# Altium project LOGTURTLE_APR_25_TX.PrjPcb (part 2 of 2)

## Sheet BiGaN.SchDoc
size A3; SheetNumber: 4; SheetTotal: 7
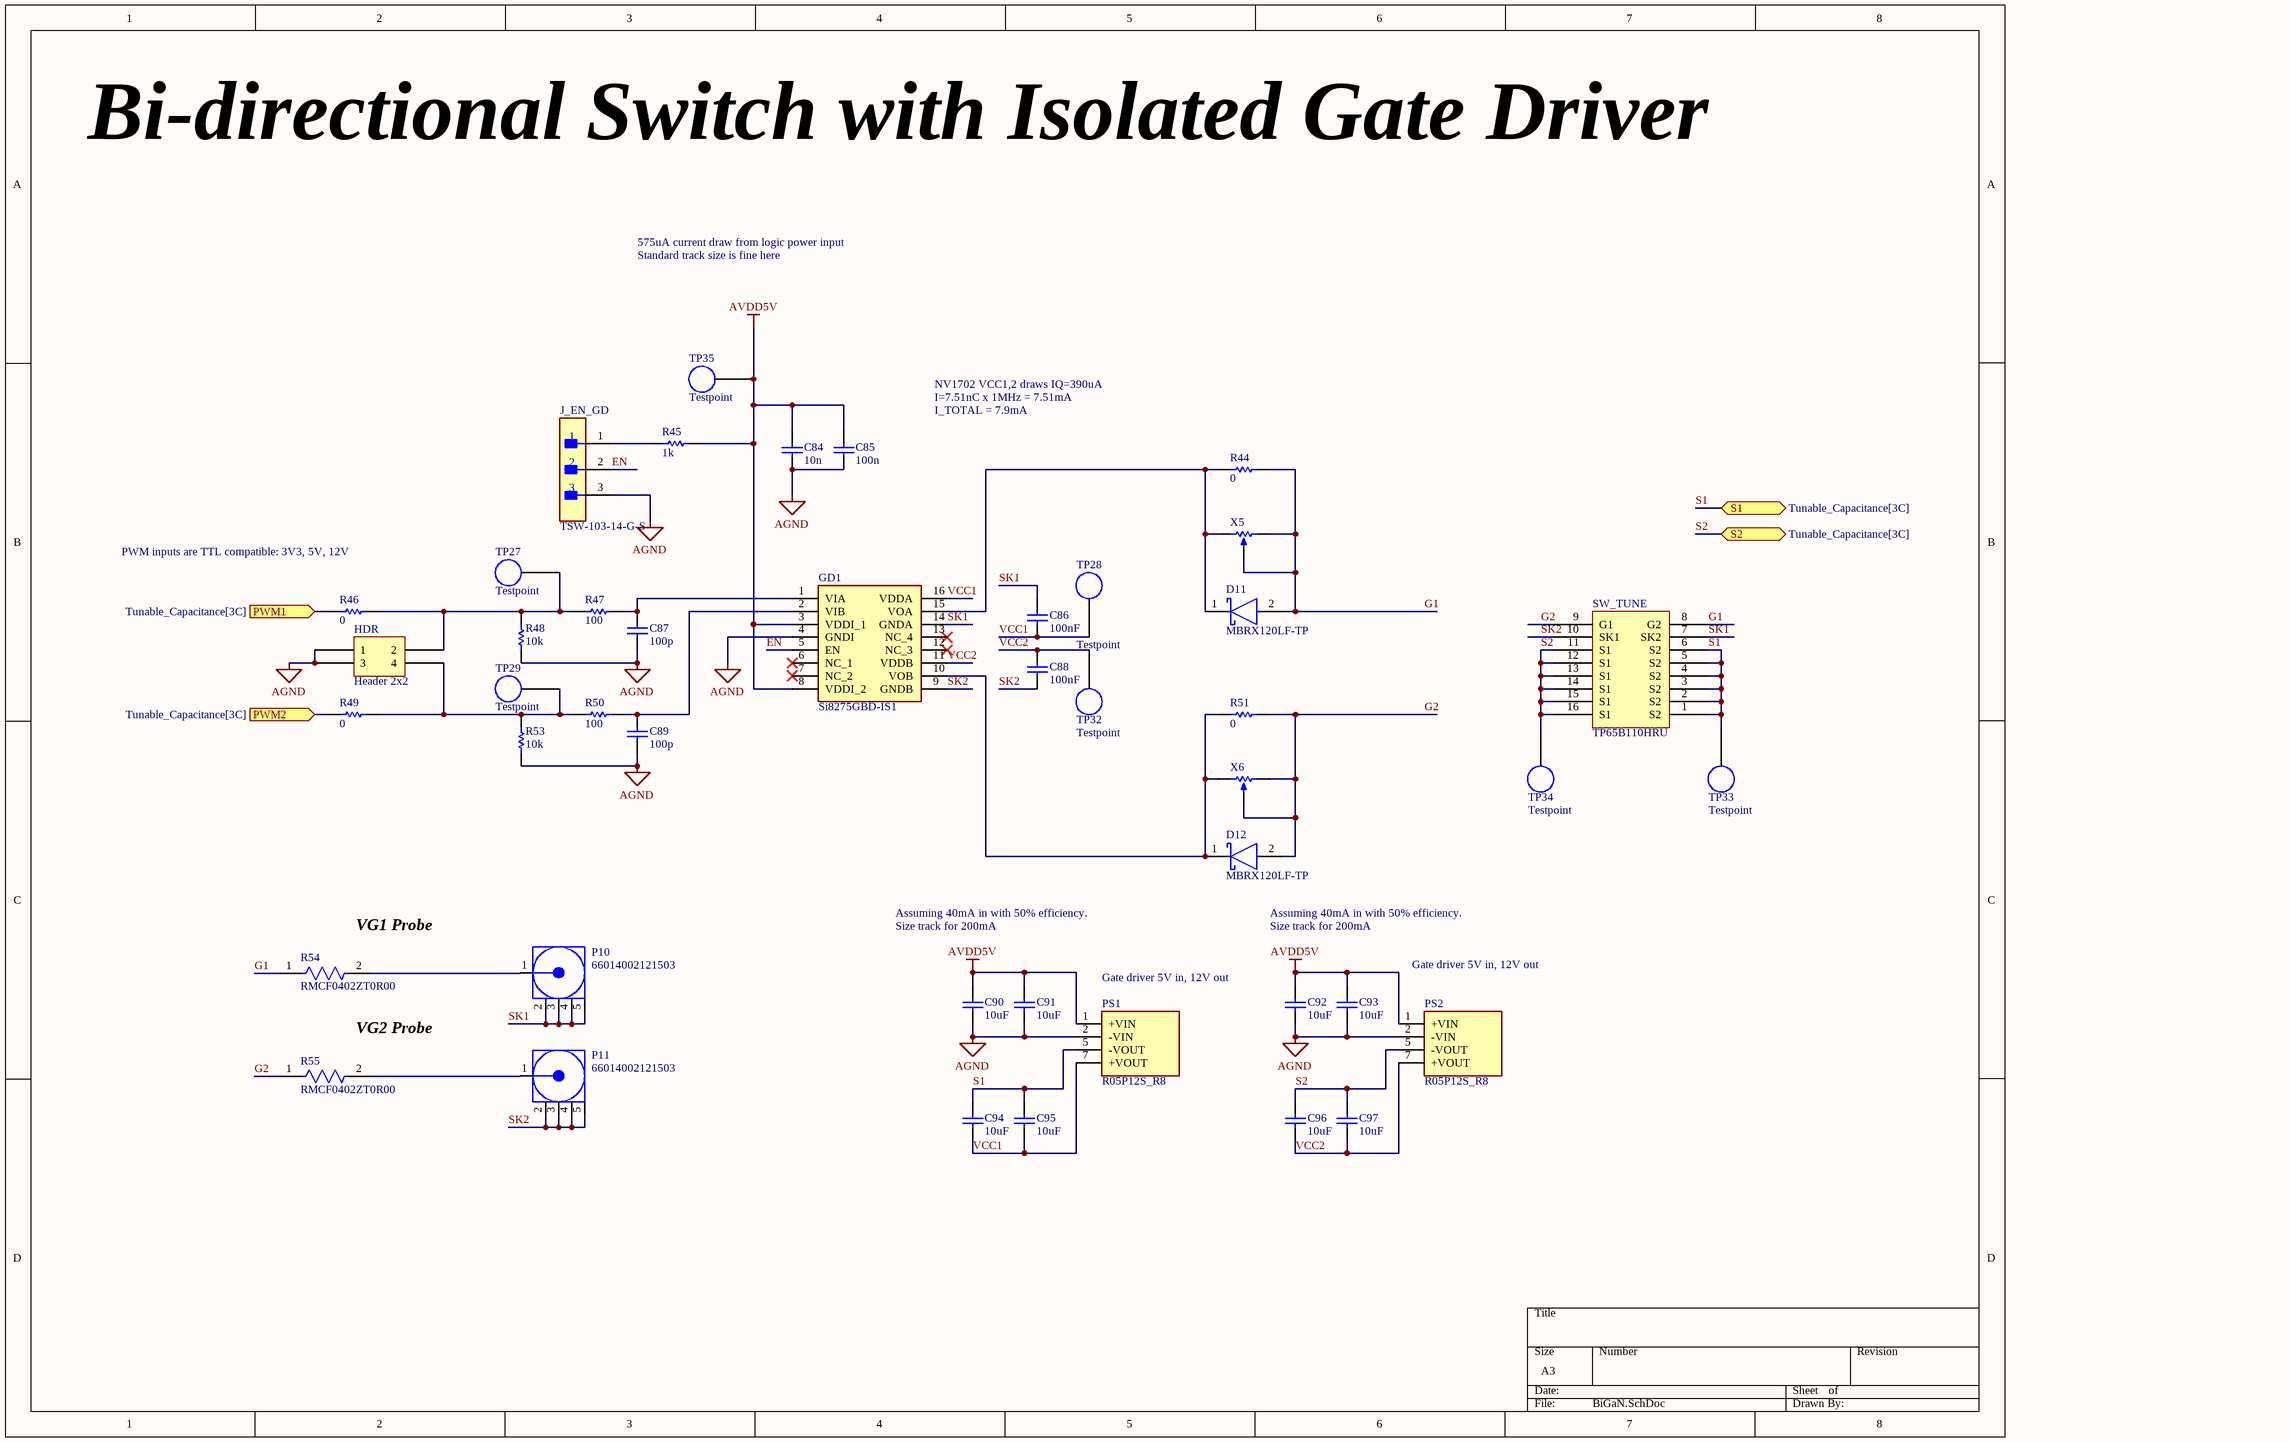
[diagram p4: BiGaN.SchDoc]

### Parts
C84  value 10n  [C0603]  (hidden comment: C0603C103K5RACTU)
C85  value 100n  [CAPC1608X95N]  (hidden comment: C0603C104K5RACTU7042)
C86  value 100nF  [CAPC1608X90N]  (hidden comment: 0.1μF)
C87  value 100p  [CAPC1608X90N]  (hidden comment: CL10C101JB8NNNC)
C88  value 100nF  [CAPC1608X90N]  (hidden comment: 0.1μF)
C89  value 100p  [CAPC1608X90N]  (hidden comment: CL10C101JB8NNNC)
C90  value 10uF  [CAPC2012X14N]  (hidden comment: 10μF)
C91  value 10uF  [CAPC2012X14N]  (hidden comment: 10μF)
C92  value 10uF  [CAPC2012X14N]  (hidden comment: 10μF)
C93  value 10uF  [CAPC2012X14N]  (hidden comment: 10μF)
C94  value 10uF  [CAPC2012X14N]  (hidden comment: 10μF)
C95  value 10uF  [CAPC2012X14N]  (hidden comment: 10μF)
C96  value 10uF  [CAPC2012X14N]  (hidden comment: 10μF)
C97  value 10uF  [CAPC2012X14N]  (hidden comment: 10μF)
D11  MBRX120LF-TP  [FP-SOD-123-IPC_A]
D12  MBRX120LF-TP  [FP-SOD-123-IPC_A]
GD1  Si8275GBD-IS1  [SOIC127P600X175-16N]
HDR  Header 2x2  [HEADER 2x2]
J_EN_GD  TSW-103-14-G-S  [FP-TSW-103-14-G-S-MFG]
P10  66014002121503  [66014002121503]
P11  66014002121503  [66014002121503]
PS1  R05P12S_R8  [R05P12SR8]
PS2  R05P12S_R8  [R05P12SR8]
R44  value 0  [RESC1608X55N]  (hidden comment: RC0603FR-070RL)
R45  value 1k  [RESC1608X55N]  (hidden comment: RC0603FR-071KL)
R46  value 0  [RESC1608X55N]  (hidden comment: RC0603FR-070RL)
R47  value 100  [RESC1608X55N]  (hidden comment: RC0603FR-07100RL)
R48  value 10k  [RESC1608X55N]  (hidden comment: RC0603FR0710KL)
R49  value 0  [RESC1608X55N]  (hidden comment: RC0603FR-070RL)
R50  value 100  [RESC1608X55N]  (hidden comment: RC0603FR-07100RL)
R51  value 0  [RESC1608X55N]  (hidden comment: RC0603FR-070RL)
R53  value 10k  [RESC1608X55N]  (hidden comment: RC0603FR0710KL)
R54  RMCF0402ZT0R00  [FP-RMCF0402-MFG]
R55  RMCF0402ZT0R00  [FP-RMCF0402-MFG]
SW_TUNE  TP65B110HRU  [NV6428]
TP27  Testpoint  [TP_5006]
TP28  Testpoint  [TP_5006]
TP29  Testpoint  [TP_5006]
TP32  Testpoint  [TP_5006]
TP33  Testpoint  [TP_5006]
TP34  Testpoint  [TP_5006]
TP35  Testpoint  [TP_5006]
X5  3296W-1-200LF  [3296W1200LF]  (value not drawn)
X6  3296W-1-200LF  [3296W1200LF]  (value not drawn)

### Ports
PWM1 (in, see Tunable_Capacitance[3C]), PWM2 (in, see Tunable_Capacitance[3C]), S1 (bidir, see Tunable_Capacitance[3C]), S2 (bidir, see Tunable_Capacitance[3C])

### Nets
AVDD5V: C84.2 C85.2 C90.2 C91.2 C92.2 C93.2 GD1.3(VDDI_1) GD1.8(VDDI_2) PS1.1(+VIN) PS2.1(+VIN) R45.2 TP35.1
S2: C84.1 C85.1 C87.1 C89.1 C90.1 C91.1 C92.1 C93.1 C96.1 C97.1 GD1.4(GNDI) HDR.1 HDR.3 J_EN_GD.3 PS1.2(-VIN) PS2.2(-VIN) PS2.5(-VOUT) R48.1 R53.1 SW_TUNE.11(S1) SW_TUNE.12(S1) SW_TUNE.13(S1) SW_TUNE.14(S1) SW_TUNE.15(S1) SW_TUNE.16(S1) TP34.1 ; port S2  [also labelled AGND]
EN: GD1.5(EN) J_EN_GD.2
G1: D11.2(A) R44.2 R54.1 SW_TUNE.8(G2) X5.2(BOT) X5.3(TAP)
G2: D12.2(A) R51.2 R55.1 SW_TUNE.9(G1) X6.2(BOT) X6.3(TAP)
PWM1_1: R46.1 ; port PWM1
PWM2_1: R49.1 ; port PWM2
S1: C94.1 C95.1 PS1.5(-VOUT) SW_TUNE.1(S2) SW_TUNE.2(S2) SW_TUNE.3(S2) SW_TUNE.4(S2) SW_TUNE.5(S2) SW_TUNE.6(S2) TP33.1 ; port S1
SK1: C86.1 GD1.14(GNDA) P10.2(GND) P10.3(GND) P10.4(GND) P10.5(GND) SW_TUNE.7(SK2)
SK2: C88.2 GD1.9(GNDB) P11.2(GND) P11.3(GND) P11.4(GND) P11.5(GND) SW_TUNE.10(SK1)
VCC1: C86.2 C94.2 C95.2 GD1.16(VDDA) PS1.7(+VOUT) TP28.1
VCC2: C88.1 C96.2 C97.2 GD1.11(VDDB) PS2.7(+VOUT) TP32.1
NetC87_2: C87.2 GD1.1(VIA) R47.2
NetC89_2: C89.2 GD1.2(VIB) R50.2
NetD11_1: D11.1(C) GD1.15(VOA) R44.1 X5.1(TOP)
NetD12_1: D12.1(C) GD1.10(VOB) R51.1 X6.1(TOP)
NetHDR_2: HDR.2 R46.2 R47.1 R48.2 TP27.1
NetHDR_4: HDR.4 R49.2 R50.1 R53.2 TP29.1
NetJ_EN_GD_1: J_EN_GD.1 R45.1
NetP10_1: P10.1(Signal) R54.2
NetP11_1: P11.1(Signal) R55.2

Not connected (* = marked no-connect by the designer): GD1 6(NC_1)* 7(NC_2)* 12(NC_3)* 13(NC_4)*

### Notes on the sheet
- Bi-directional Switch with Isolated Gate Driver
- 575uA current draw from logic power input
- Standard track size is fine here
- NV1702 VCC1,2 draws IQ=390uA
- I=7.51nC x 1MHz = 7.51mA
- I_TOTAL = 7.9mA
- PWM inputs are TTL compatible: 3V3, 5V, 12V
- (near R54) VG1 Probe
- Assuming 40mA in with 50% efficiency.
- Size track for 200mA
- Gate driver 5V in, 12V out
- VG2 Probe

### Library data of the parts
C84 = C0603C103K5RACTU: Capacitor, 10000 pF ±10% 50V Ceramic Capacitor X7R 0603 (1608 Metric); Manufacturer_Name: YAGEO; Datasheet Link: https://content.kemet.com/datasheets/KEM_C1002_X7R_SMD.pdf; Height: 0.87mm; Manufacturer_Part_Number: C0603C103K5RACTU; Mouser Part Number: 80-C0603C103K5R; Mouser Price/Stock: https://www.mouser.co.uk/ProductDetail/KEMET/C0603C103K5RACTU?qs=aZBT8IJKz4hu1X55tMAU6Q%3D%3D; Arrow Part Number: C0603C103K5RACTU; Arrow Price/Stock: https://www.arrow.com/en/products/c0603c103k5ractu/kemet-corporation?utm_currency=USD&region=nac
C85 = C0603C104K5RACTU7042: Capacitor, 0.1 µF ±10% 50V Ceramic Capacitor X7R 0603 (1608 Metric); Manufacturer_Name: YAGEO; Height: 0.95mm; Datasheet Link: https://www.arrow.com/en/products/c0603c104k5ractu7042/kemet-corporation; Manufacturer_Part_Number: C0603C104K5RACTU7042; Arrow Part Number: C0603C104K5RACTU7042; Arrow Price/Stock: https://www.arrow.com/en/products/c0603c104k5ractu7042/kemet-corporation
C86 C88 = CC0603KRX7R7BB104: Ceramic Capacitor, Multilayer, Ceramic, 16V, 10% +Tol, 10% -Tol, X7R, 15% TC, 0.1uF, Surface Mount, 0603 https://www.digikey.ie/en/products/detail/yageo/CC0603KRX7R7BB104/302822; Manufacturer: Yageo; Multilayer: Yes; Supplier: Digikey; Supplier Part Number: 311-1088-1-ND; Manufacturer Part Number: CC0603KRX7R7BB104; RoHS: Yes; Category: Ceramic Capacitors; Stock: 8597331; Mounting Technology: Surface Mount; Pins: 2; Dielectric Material: Ceramic; Package Shape: Rectangular; Case/Package: 0603; Terminal Finish: Nickel; Min Operating Temperature: -55°C; Max Operating Temperature: 125°C; JESD-609 Code: e3; Capacitor Type: Ceramic; Tolerance  (fill in as +-): 10%; Package Style: SMTMeter; Packaging: Tape and Reel; Tolerance (fill in as +-): 10%; Rated DC Voltage (URdc): 16V; Temperature Characteristics Code: X7R; Termination: Wraparound; Length: 1.6mm; Width: 0.8mm; Height: 0.8mm; Reach SVHC Compliant: Yes; RoHS Compliant: Yes; ComponentLink1URL: https://datasheet.ciiva.com:443/pdfs/VipMasterIC/IC/YAGO/YAGO-S-A0003557223/YAGO-S-A0003557223-1.pdf?src-supplier=IHS+Markit; ComponentLink1Description: https://datasheet.ciiva.com:443/pdfs/VipMasterIC/IC/YAGO/YAGO-S-A0003557223/YAGO-S-A0003557223-1.pdf?src-supplier=IHS+Markit; ComponentLink2URL: https://datasheet.ciiva.com/11786/0900766b80d84f1d-11786077.pdf?src-supplier=Rs; ComponentLink2Description: https://datasheet.ciiva.com/11786/0900766b80d84f1d-11786077.pdf?src-supplier=Rs; ComponentLink3URL: https://datasheet.ciiva.com/8033/70765-8033799.pdf?src-supplier=Element14; ComponentLink3Description: https://datasheet.ciiva.com/8033/70765-8033799.pdf?src-supplier=Element14; ComponentLink4URL: https://datasheet.ciiva.com/7978/1489800-7978141.pdf?src-supplier=Element14; ComponentLink4Description: https://datasheet.ciiva.com/7978/1489800-7978141.pdf?src-supplier=Element14; ComponentLink5URL: https://datasheet.ciiva.com/28450/1489800-28450552.pdf?src-supplier=Element14; ComponentLink5Description: https://datasheet.ciiva.com/28450/1489800-28450552.pdf?src-supplier=Element14; ComponentLink6URL: https://datasheet.ciiva.com/46430/1734573-46430156.pdf?src-supplier=Element14; ComponentLink6Description: https://datasheet.ciiva.com/46430/1734573-46430156.pdf?src-supplier=Element14; ComponentLink7URL: https://datasheet.ciiva.com/144/mlccorderingcode-144183.pdf?src-supplier=Digikey; ComponentLink7Description: https://datasheet.ciiva.com/144/mlccorderingcode-144183.pdf?src-supplier=Digikey; ComponentLink8URL: https://datasheet.ciiva.com/144/mlccorderingcode-144182.pdf?src-supplier=Digikey; ComponentLink8Description: https://datasheet.ciiva.com/144/mlccorderingcode-144182.pdf?src-supplier=Digikey; ComponentLink9URL: https://datasheet.ciiva.com/144/mlccorderingcode-144184.pdf?src-supplier=Digikey; ComponentLink9Description: https://datasheet.ciiva.com/144/mlccorderingcode-144184.pdf?src-supplier=Digikey; ComponentLink10URL: https://datasheet.ciiva.com/8033/1734573-8033797.pdf?src-supplier=Element14; ComponentLink10Description: https://datasheet.ciiva.com/8033/1734573-8033797.pdf?src-supplier=Element14; ComponentLink11URL: https://datasheet.ciiva.com/13395/upy-gphc-x7r-6-3v-to-50v-8-13395674.pdf?src-supplier=Mouser; ComponentLink11Description: https://datasheet.ciiva.com/13395/upy-gphc-x7r-6-3v-to-50v-8-13395674.pdf?src-supplier=Mouser
C87 C89 = CL10C101JB8NNNC: Capacitor, 100 pF ±5% 50V Ceramic Capacitor C0G, NP0 0603 (1608 Metric); Manufacturer_Name: SAMSUNG; Datasheet Link: https://lcsc.componentsearchengine.com/Datasheets/2/CL10C101JB8NNNC.pdf; Height: 0.9mm; Manufacturer_Part_Number: CL10C101JB8NNNC; Mouser Part Number: 187-CL10C101JB8NNNC; Mouser Price/Stock: https://www.mouser.co.uk/ProductDetail/Samsung-Electro-Mechanics/CL10C101JB8NNNC?qs=349EhDEZ59pXXooLigsK%2FQ%3D%3D; Arrow Part Number: CL10C101JB8NNNC; Arrow Price/Stock: https://www.arrow.com/en/products/cl10c101jb8nnnc/samsung-electro-mechanics?region=europe
C90-C97 = GRM21BZ71E106KE15L: Multilayer Ceramic Capacitor, 10 uF, 25 V, ï¿½ 10%, X7R, 0805 [2012 Metric] https://www.digikey.ie/en/products/detail/murata-electronics/GRM21BZ71E106KE15L/13904911; Manufacturer: Murata; Material: 4241ConductorMaterial; Voltage Rating: 25V; Supplier: Future Electronics; Supplier Part Number: 6134628; Manufacturer Part Number: GRM21BZ71E106KE15L; Category: Ceramic Capacitors; Stock: 81000; Case/Package: 339Case; Min Operating Temperature: -55°C; Max Operating Temperature: 125°C; Tolerance: 10%; Length: 2mm; Width: 1.25mm; Height: 1.45mm; Thickness: 1.25mm; RoHS Compliant: Yes; ComponentLink1URL: https://datasheet.octopart.com/GRM21BZ71E106KE15L-Murata-datasheet-141278873.pdf?src-supplier=Geoflip; ComponentLink1Description: https://datasheet.octopart.com/GRM21BZ71E106KE15L-Murata-datasheet-141278873.pdf?src-supplier=Geoflip; ComponentLink2URL: https://datasheet.octopart.com/GRM21BZ71E106KE15L-Murata-datasheet-165579666.pdf?src-supplier=TME; ComponentLink2Description: https://datasheet.octopart.com/GRM21BZ71E106KE15L-Murata-datasheet-165579666.pdf?src-supplier=TME; ComponentLink3URL: https://datasheet.octopart.com/GRM21BZ71E106KE15L-Murata-datasheet-140707837.pdf?src-supplier=Ciiva+Crawler; ComponentLink3Description: https://datasheet.octopart.com/GRM21BZ71E106KE15L-Murata-datasheet-140707837.pdf?src-supplier=Ciiva+Crawler; ComponentLink4URL: https://datasheet.octopart.com/GRM21BZ71E106KE15L-Murata-datasheet-138745134.pdf?src-supplier=Ciiva+Crawler; ComponentLink4Description: https://datasheet.octopart.com/GRM21BZ71E106KE15L-Murata-datasheet-138745134.pdf?src-supplier=Ciiva+Crawler
D11 D12 = CMP-56206-000012-1: DIODE SCHOTTKY 20V 1A SOD123; Max Power Dissipation: 556mW; Forward Voltage: 360mV; Peak Non-Repetitive Surge Current: 12A; Element Configuration: Single; Max Reverse Voltage (DC): 20V; Lead Free: Lead Free; Max Operating Temperature: 125°C; Radiation Hardening: No; Mount: Surface Mount; Number of Pins: 2; Average Rectified Current: 1A; Min Operating Temperature: -65°C; Max Repetitive Reverse Voltage (Vrrm): 20V; RoHS Compliant: Yes; Package Quantity: 1; Max Forward Surge Current (Ifsm): 12A; Packaging: Tape and Reel; Max Surge Current: 12A; Forward Current: 1A
GD1 = Si8275GBD-IS1: Integrated Circuit; Manufacturer_Name: Silicon Labs; Datasheet Link: https://www.silabs.com/documents/public/data-sheets/Si827x.pdf; Height: 1.75mm; Manufacturer_Part_Number: Si8275GBD-IS1; Mouser Part Number: 634-SI8275GBD-IS1; Mouser Price/Stock: https://www.mouser.co.uk/ProductDetail/Silicon-Labs/SI8275GBD-IS1?qs=j6MGy4L9yX2SPc9HOZMvjA%3D%3D; Arrow Part Number: SI8275GBD-IS1; Arrow Price/Stock: https://www.arrow.com/en/products/si8275gbd-is1/silicon-labs
HDR = Header 2x2: Connector Header Through Hole 4 position 0.100" (2.54mm), PH2-04-UA
J_EN_GD = CMP-02766-001743-1: CONN HEADER VERT 3POS 2.54MM; Max Voltage Rating (AC): 550V; Number of Positions: 3; Max Current Rating: 7.6A; Gender: Male; Termination: Solder; RoHS Compliant: Yes; Mount: Through Hole; Lead Free: Lead Free; Connector Type: Header; REACH SVHC: No SVHC; Insulation Color: Black; Width: 2.54mm; Length: 7.62mm; Flammability Rating: UL94 V-0; Housing Material: Polyester; Contact Material: Bronze; Max Operating Temperature: 125°C; Fastening Type: Pull; Series: TSW; Number of Contacts: 3; Packaging: Bulk; Min Operating Temperature: -55°C; Package Quantity: 1; Height: 10.67mm; Pitch: 2.54mm; Contact Finish - Mating: GOLD; Contact Type: Male Pin; Radiation Hardening: No; Color: Black; Housing Color: Black; Contact Plating: Gold; Orientation: Straight; Number of Rows: 1; Depth: 2.54mm; Insulation Material: PBT; Contact Mating Length: 0.32inch; Contact Shape: Square
P10 P11 = CMP-03913-103108763-2: Connector, Tht Mount, Straight, 0.7 Cbl Dia., 50 Ohms, Wr-mmcx; Insertion Loss (dB): 0.25dB; Insulation Resistance: 1GΩ; Connector Type: MMCX; Impedance: 50Ω; Min Operating Temperature: -55°C; Max Operating Temperature: 155°C; Insulation Material: PTFE
PS1 PS2 = R05P12S_R8: Power Supply; Manufacturer_Name: RECOM Power; Manufacturer_Part_Number: R05P12S/R8; Datasheet Link: https://www.mouser.de/datasheet/2/468/RxxPxx_R-1710046.pdf; Height: 13mm; Mouser Part Number: 919-R05P12SR8; Mouser Price/Stock: https://www.mouser.co.uk/ProductDetail/RECOM-Power/R05P12S-R8?qs=%252BHKxvJ84kqo5EQ%2FKTjgTzw%3D%3D
R44 R46 R49 R51 = RC0603FR-070RL: Resistor, 0 Ohms Jumper 0.1W, 1/10W Chip Resistor 0603 (1608 Metric) Moisture Resistant Thick Film; Manufacturer_Name: YAGEO; Datasheet Link: http://www.yageo.com/documents/recent/PYu-RC0603_51_RoHS_L_v5.pdf; Height: 0.55mm; Manufacturer_Part_Number: RC0603FR-070RL; Mouser Part Number: 603-RC0603FR-070RL; Mouser Price/Stock: https://www.mouser.co.uk/ProductDetail/YAGEO/RC0603FR-070RL?qs=0yPvnVz5%2FmpDQv43TwvCfw%3D%3D; Arrow Part Number: RC0603FR-070RL; Arrow Price/Stock: https://www.arrow.com/en/products/rc0603fr-070rl/yageo?region=nac
R45 = RC0603FR-071KL: Resistor, 1 kOhms ±1% 0.1W, 1/10W Chip Resistor 0603 (1608 Metric) Moisture Resistant Thick Film; Manufacturer_Name: YAGEO; Datasheet Link: https://www.yageo.com/upload/media/product/productsearch/datasheet/rchip/PYu-RC_Group_51_RoHS_L_12.pdf; Height: 0.55mm; Manufacturer_Part_Number: RC0603FR-071KL; Mouser Part Number: 603-RC0603FR-071KL; Mouser Price/Stock: https://www.mouser.co.uk/ProductDetail/YAGEO/RC0603FR-071KL?qs=VU8sRB4EgwApHsk4rF%2F3zg%3D%3D; Arrow Part Number: RC0603FR-071KL; Arrow Price/Stock: https://www.arrow.com/en/products/rc0603fr-071kl/yageo?utm_currency=USD&region=nac
R47 R50 = RC0603FR-07100RL: Resistor, 100 Ohms ±1% 0.1W, 1/10W Chip Resistor 0603 (1608 Metric) Moisture Resistant Thick Film; Manufacturer_Name: YAGEO; Datasheet Link: http://www.yageo.com/documents/recent/PYu-RC0603_51_RoHS_L_v5.pdf; Height: 0.55mm; Manufacturer_Part_Number: RC0603FR-07100RL; Mouser Part Number: 603-RC0603FR-07100RL; Mouser Price/Stock: https://www.mouser.co.uk/ProductDetail/YAGEO/RC0603FR-07100RL?qs=NEN%2FsE%2FLsvPIwIWKCOS4%2FA%3D%3D; Arrow Part Number: RC0603FR-07100RL; Arrow Price/Stock: https://www.arrow.com/en/products/rc0603fr-07100rl/yageo?region=europe
R48 R53 = RC0603FR0710KL: Resistor, 10 kOhms ±1% 0.1W, 1/10W Chip Resistor 0603 (1608 Metric) Moisture Resistant Thick Film; Manufacturer_Name: YAGEO; Datasheet Link: http://www.yageo.com/documents/recent/PYu-RC0603_51_RoHS_L_v5.pdf; Height: 0.55mm; Manufacturer_Part_Number: RC0603FR0710KL; Arrow Part Number: RC0603FR0710KL; Arrow Price/Stock: https://www.arrow.com/en/products/rc0603fr-0710kl/yageo
R54 R55 = CMP-26527-007617-1: RES 0 OHM JUMPER 1/16W 0402; Power Rating: 63mW; Working Voltage: 50V; Current Rating: 1A; Resistance: 0R; Series: RMCF; RoHS Compliant: Yes; Features: Automotive AEC-Q200; Width: 0.02inch; Depth: 0.5mm; Resistor Type: Thick Film; Number of Terminations: 2; Radiation Hardening: No; Length: 0.039inch; Contact Plating: Tin; Case/Package: 0402; Min Operating Temperature: -55°C; Case Code (Metric): 1005; Construction: Rectangular; Mount: Surface Mount; Max Operating Temperature: 155°C; Max Power Dissipation: 63mW; Height: 0.016inch; Lead Free: Lead Free; Packaging: Tape and Reel; Technology: THICK FILM; Case Code (Imperial): 0402; Military Standard: Not
SW_TUNE = TP65B110HRU: Renesas bidirection GaN switch / https://www.renesas.com/en/document/dst/tp65b110hru-datasheet?r=25610905
X5 X6 = 3296W-1-200LF: Variable Resistor; Manufacturer_Name: Bourns; Datasheet Link: https://componentsearchengine.com/Datasheets/2/3296W-1-200LF.pdf; Height: 10.28mm; Manufacturer_Part_Number: 3296W-1-200LF; Mouser Part Number: 652-3296W-1-200LF; Mouser Price/Stock: https://www.mouser.co.uk/ProductDetail/Bourns/3296W-1-200LF?qs=R4%2FAj8xQbdUOcUUWJIVY1Q%3D%3D; Arrow Part Number: 3296W-1-200LF; Arrow Price/Stock: https://www.arrow.com/en/products/3296w-1-200lf/bourns?utm_currency=USD&region=nac

## Sheet ComparatorSense.SchDoc
size A3; SheetNumber: 6; SheetTotal: 7
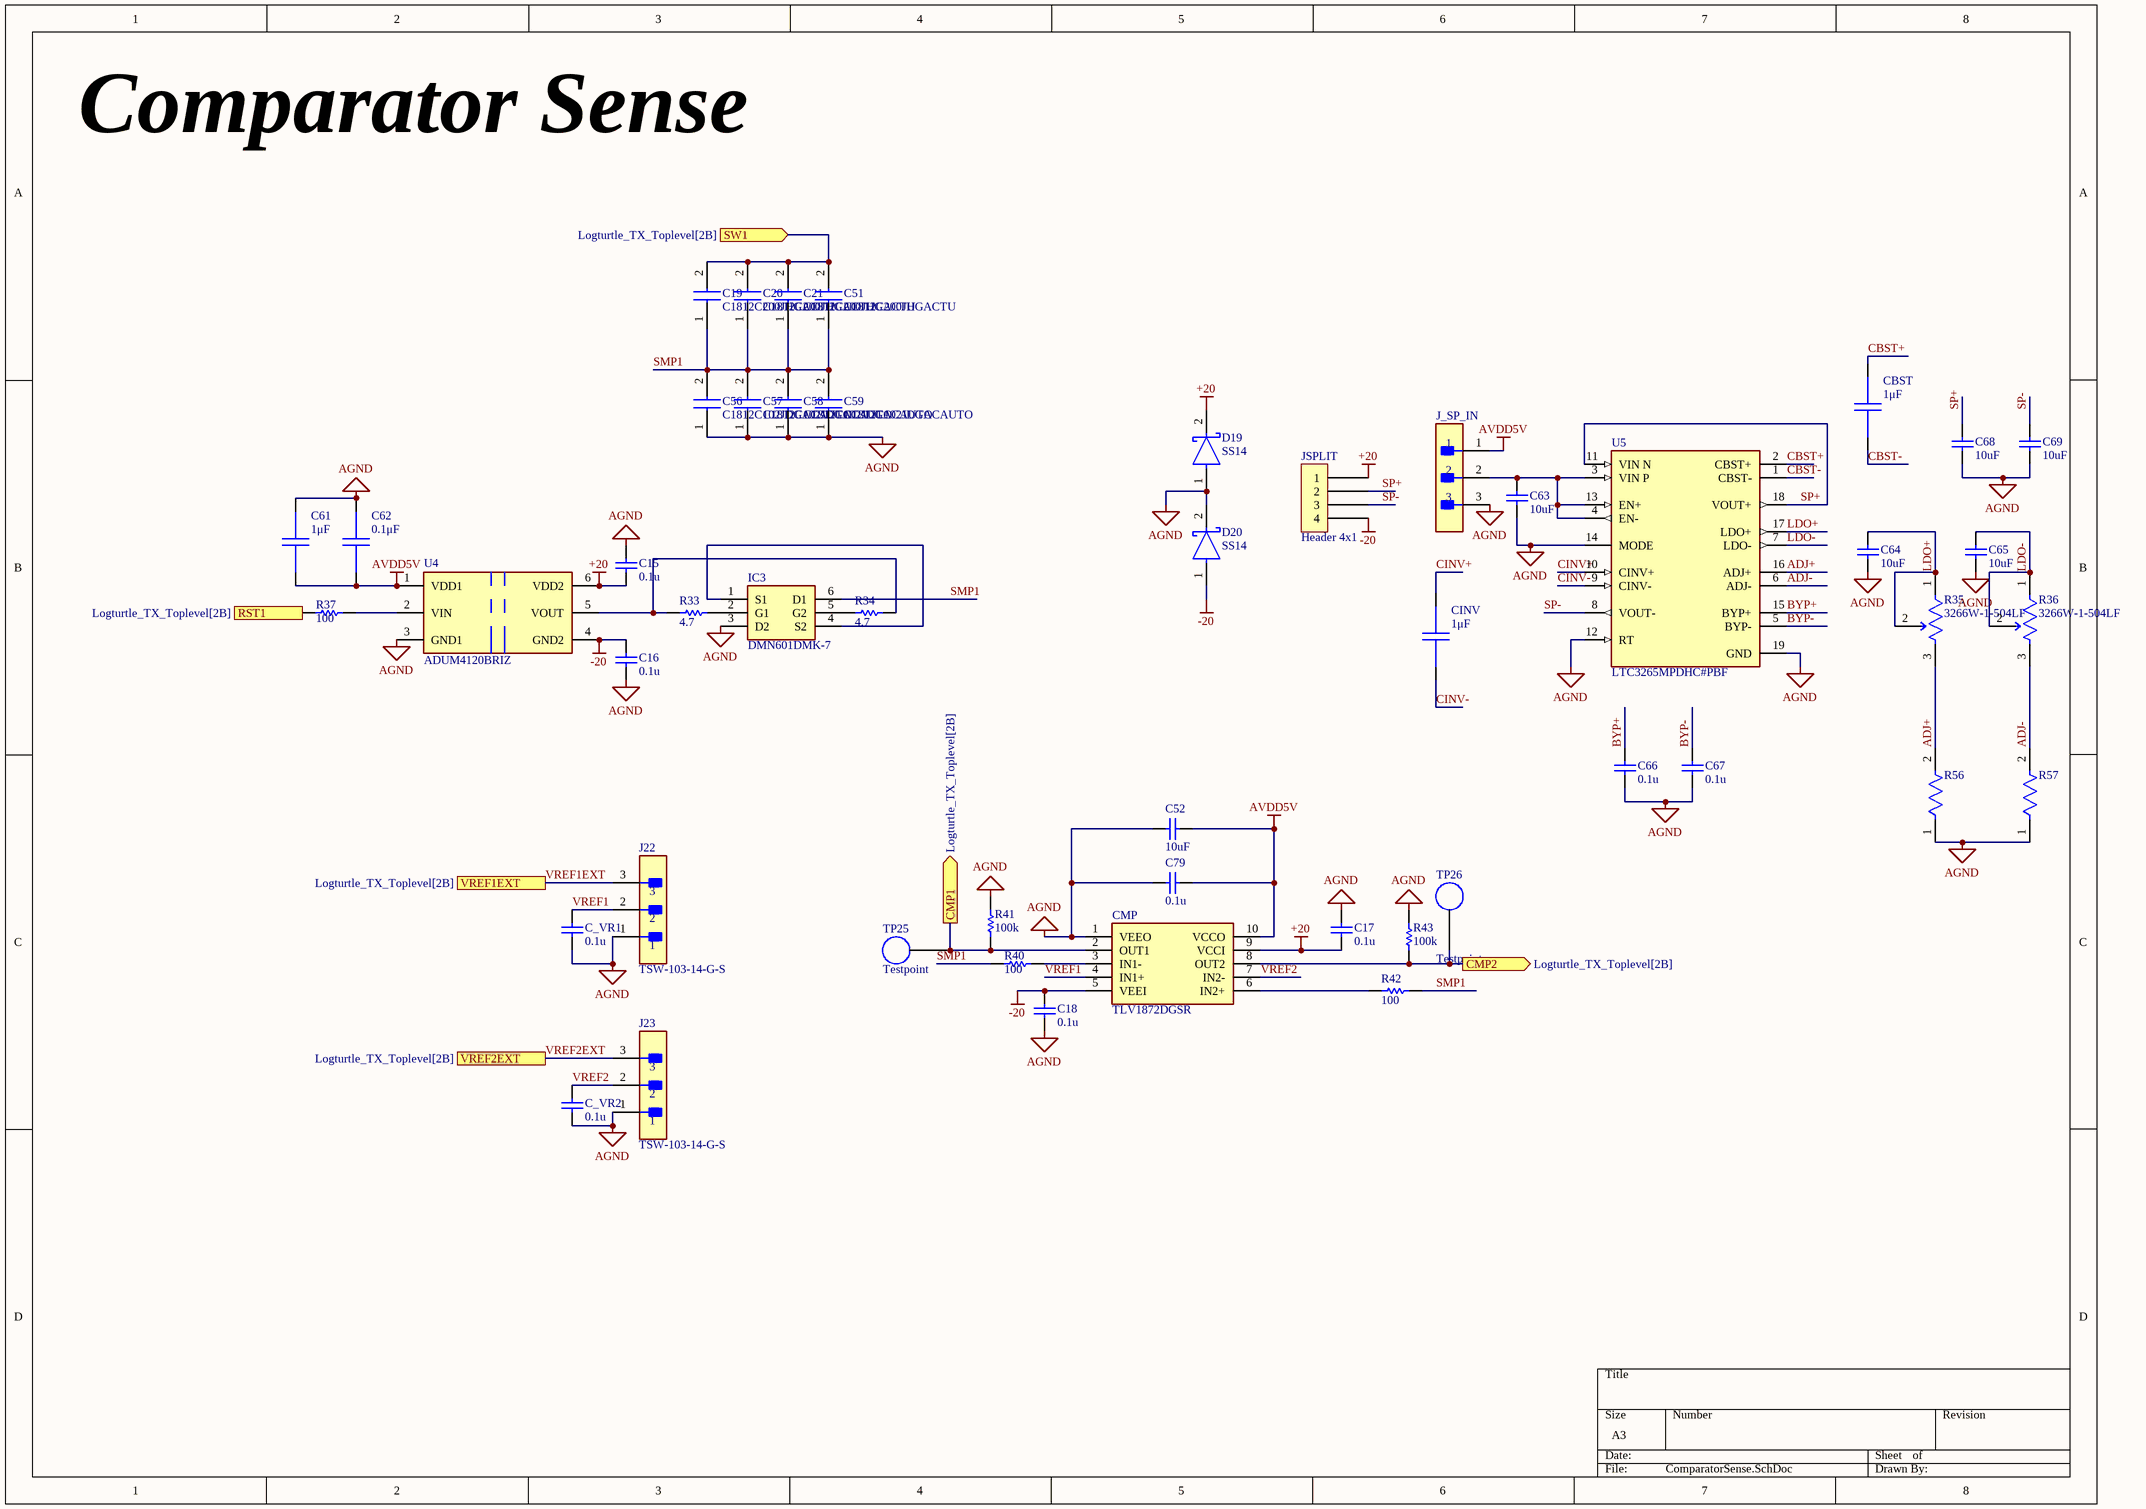
[diagram p5: ComparatorSense.SchDoc]

### Parts
C15  value 0.1u  [CAPC1608X09N]  (hidden comment: Capacitor)
C16  value 0.1u  [CAPC1608X09N]  (hidden comment: Capacitor)
C17  value 0.1u  [CAPC1608X09N]  (hidden comment: Capacitor)
C18  value 0.1u  [CAPC1608X09N]  (hidden comment: Capacitor)
C19  C1812C200JHGACTU  [C1812]
C20  C1812C200JHGACTU  [C1812]
C21  C1812C200JHGACTU  [C1812]
C51  C1812C200JHGACTU  [C1812]
C52  value 10uF  [CAPC2012X14N]  (hidden comment: 10μF)
C56  C1812C102JDGACAUTO  [C1812]
C57  C1812C102JDGACAUTO  [C1812]
C58  C1812C102JDGACAUTO  [C1812]
C59  C1812C102JDGACAUTO  [C1812]
C61  1μF  [CAPC1608X09N]
C62  0.1μF  [CAPC1608X90N]
C63  value 10uF  [CAPC2012X14N]  (hidden comment: 10μF)
C64  value 10uF  [CAPC2012X14N]  (hidden comment: 10μF)
C65  value 10uF  [CAPC2012X14N]  (hidden comment: 10μF)
C66  value 0.1u  [CAPC1608X09N]  (hidden comment: Capacitor)
C67  value 0.1u  [CAPC1608X09N]  (hidden comment: Capacitor)
C68  value 10uF  [CAPC2012X14N]  (hidden comment: 10μF)
C69  value 10uF  [CAPC2012X14N]  (hidden comment: 10μF)
C79  value 0.1u  [CAPC1608X09N]  (hidden comment: Capacitor)
C_VR1  value 0.1u  [CAPC1608X09N]  (hidden comment: Capacitor)
C_VR2  value 0.1u  [CAPC1608X09N]  (hidden comment: Capacitor)
CBST  1μF  [CAPC1608X09N]
CINV  1μF  [CAPC1608X09N]
CMP  TLV1872DGSR  [SOP50P490X110-10N]
D19  SS14  [FP-403AE-MFG]
D20  SS14  [FP-403AE-MFG]
IC3  DMN601DMK-7  [SOT95P285X140-6N]
J22  TSW-103-14-G-S  [FP-TSW-103-14-G-S-MFG]
J23  TSW-103-14-G-S  [FP-TSW-103-14-G-S-MFG]
J_SP_IN  TSW-103-14-G-S  [FP-TSW-103-14-G-S-MFG]  (value not drawn)
JSPLIT  Header 4x1  [HDRV4W64P0X254_1X4_1016X250X901P]
R33  value 4.7  [RESC1608X55N]  (hidden comment: RC0603FR-07100RL)
R34  value 4.7  [RESC1608X55N]  (hidden comment: RC0603FR-07100RL)
R35  3266W-1-504LF  [FP-3266W-MFG]
R36  3266W-1-504LF  [FP-3266W-MFG]
R37  value 100  [RESC1608X55N]  (hidden comment: RC0603FR-07100RL)
R40  value 100  [RESC1608X55N]  (hidden comment: RC0603FR-07100RL)
R41  value 100k  [RESC1608X55N]  (hidden comment: RC0603FR-07100KL)
R42  value 100  [RESC1608X55N]  (hidden comment: RC0603FR-07100RL)
R43  value 100k  [RESC1608X55N]  (hidden comment: RC0603FR-07100KL)
R56  TNPU060350K0HZEN00  [FP-TNPU0603-e3-MFG]  (value not drawn)
R57  TNPU060350K0HZEN00  [FP-TNPU0603-e3-MFG]  (value not drawn)
TP25  Testpoint  [TP_5006]
TP26  Testpoint  [TP_5006]
U4  ADUM4120BRIZ  [FP-RI-6-1-IPC_A]
U5  LTC3265MPDHC#PBF  [FP-DHC-18-05-08-1955-IPC_C]

### Ports
CMP1 (out, see Logturtle_TX_Toplevel[2B]), CMP2 (out, see Logturtle_TX_Toplevel[2B]), RST1 (in, see Logturtle_TX_Toplevel[2B]), SW1 (in, see Logturtle_TX_Toplevel[2B]), VREF1EXT (see Logturtle_TX_Toplevel[2B]), VREF2EXT (see Logturtle_TX_Toplevel[2B])

### Nets
+20: C15.2 C17.2 CMP.9(VCCI) D19.2(C) JSPLIT.1 U4.6(VDD2)
-20: C16.2 C18.2 CMP.5(VEEI) D20.1(A) JSPLIT.4 U4.4(GND2)
AGND: C15.1 C16.1 C17.1 C18.1 C52.1 C56.1 C57.1 C58.1 C59.1 C61.1 C62.1 C63.1 C64.1 C65.1 C66.2 C67.2 C68.1 C69.1 C79.2 C_VR1.1 C_VR2.1 CMP.1(VEEO) D19.1(A) D20.2(C) IC3.3(D2) J22.1 J23.1 J_SP_IN.3 R41.1 R43.1 R56.1 R57.1 U4.3(GND1) U5.12(RT) U5.14(MODE) U5.19(GND)  [project net S2]
AVDD5V: C52.2 C61.2 C62.2 C79.1 CMP.10(VCCO) J_SP_IN.1 U4.1(VDD1)
ADJ+: R35.3(CW) R56.2 U5.16(ADJ+)
ADJ-: R36.3(CW) R57.2 U5.6(ADJ-)
BYP+: C66.1 U5.15(BYP+)
BYP-: C67.1 U5.5(BYP-)
CBST+: CBST.1 U5.2(CBST+)
CBST-: CBST.2 U5.1(CBST-)
CINV+: CINV.1 U5.10(CINV+)
CINV-: CINV.2 U5.9(CINV-)
CMP1: CMP.2(OUT1) R41.2 TP25.1 ; port CMP1
CMP2: CMP.8(OUT2) R43.2 TP26.1 ; port CMP2
CMPRST_1: R37.1 ; port RST1
LDO+: C64.2 R35.1(CCW) R35.2(WIPER) U5.17(LDO+)
LDO-: C65.2 R36.1(CCW) R36.2(WIPER) U5.7(LDO-)
S1: C19.2 C20.2 C21.2 C51.2 ; port SW1
SMP1: C19.1 C20.1 C21.1 C51.1 C56.2 C57.2 C58.2 C59.2 IC3.6(D1) R40.1 R42.1
SP+: C68.2 JSPLIT.2 U5.11(VIN_N) U5.18(VOUT+)
SP-: C69.2 JSPLIT.3 U5.8(VOUT-)
VREF1: C_VR1.2 CMP.4(IN1+) J22.2
VREF1EXT: J22.3 ; port VREF1EXT
VREF2: C_VR2.2 CMP.7(IN2-) J23.2
VREF2EXT: J23.3 ; port VREF2EXT
NetC63_2: C63.2 J_SP_IN.2 U5.3(VIN_P) U5.4(EN-) U5.13(EN+)
NetCMP_3: CMP.3(IN1-) R40.2
NetCMP_6: CMP.6(IN2+) R42.2
NetIC3_1: IC3.1(S1) IC3.4(S2)
NetIC3_2: IC3.2(G1) R33.1
NetIC3_5: IC3.5(G2) R34.2
NetR33_2: R33.2 R34.1 U4.5(VOUT)
NetR37_2: R37.2 U4.2(VIN)

### Notes on the sheet
- Comparator Sense

### Library data of the parts
C15-C18 C66 C67 C79 C_VR1 C_VR2 = Capacitor: SimulationGenericComponent: True
C19-C21 C51 C56-C59 = C1812C102JDGACAUTO: Capacitor; Manufacturer_Name: YAGEO; Datasheet Link: https://content.kemet.com/datasheets/KEM_C1080_C0G_HV_AUTO_SMD.pdf; Height: 1.55mm; Manufacturer_Part_Number: C1812C102JDGACAUTO
C52 C63-C65 C68 C69 = GRM21BZ71E106KE15L: as C90 on sheet BiGaN; Supplier: Future Electronics; Supplier Part Number: 6134628; Manufacturer Part Number: GRM21BZ71E106KE15L; Category: Ceramic Capacitors; Stock: 81000; Case/Package: 339Case; Min Operating Temperature: -55°C; Max Operating Temperature: 125°C; Tolerance: 10%; Length: 2mm; Width: 1.25mm; Height: 1.45mm; Thickness: 1.25mm; RoHS Compliant: Yes; ComponentLink1URL: https://datasheet.octopart.com/GRM21BZ71E106KE15L-Murata-datasheet-141278873.pdf?src-supplier=Geoflip; ComponentLink1Description: https://datasheet.octopart.com/GRM21BZ71E106KE15L-Murata-datasheet-141278873.pdf?src-supplier=Geoflip; ComponentLink2URL: https://datasheet.octopart.com/GRM21BZ71E106KE15L-Murata-datasheet-165579666.pdf?src-supplier=TME; ComponentLink2Description: https://datasheet.octopart.com/GRM21BZ71E106KE15L-Murata-datasheet-165579666.pdf?src-supplier=TME; ComponentLink3URL: https://datasheet.octopart.com/GRM21BZ71E106KE15L-Murata-datasheet-140707837.pdf?src-supplier=Ciiva+Crawler; ComponentLink3Description: https://datasheet.octopart.com/GRM21BZ71E106KE15L-Murata-datasheet-140707837.pdf?src-supplier=Ciiva+Crawler; ComponentLink4URL: https://datasheet.octopart.com/GRM21BZ71E106KE15L-Murata-datasheet-138745134.pdf?src-supplier=Ciiva+Crawler; ComponentLink4Description: https://datasheet.octopart.com/GRM21BZ71E106KE15L-Murata-datasheet-138745134.pdf?src-supplier=Ciiva+Crawler
C61 CBST CINV = CC0603KRX7R7BB105: Ceramic Capacitor, Multilayer, Ceramic, 16V, 10% +Tol, 10% -Tol, X7R, 15% TC, 1uF, Surface Mount, 0603 https://www.digikey.ie/en/products/detail/yageo/CC0603KRX7R7BB105/2833611; Manufacturer: Yageo; Multilayer: Yes; Supplier: Digikey; Supplier Part Number: 311-1446-6-ND; Manufacturer Part Number: CC0603KRX7R7BB105; RoHS: Yes; Category: Ceramic Capacitors; Stock: 9128438; Mounting Technology: Surface Mount; Pins: 2; Dielectric Material: Ceramic; Package Shape: Rectangular; Case/Package: 0603; Terminal Finish: Nickel; Min Operating Temperature: -55°C; Max Operating Temperature: 125°C; JESD-609 Code: e3; Value: 1uF; Capacitor Type: Ceramic; Tolerance  (fill in as +-): 10%; Package Style: SMTMeter; Packaging: Tape and Reel; Tolerance (fill in as +-): 10%; Rated DC Voltage (URdc): 16V; Temperature Characteristics Code: X7R; Termination: Wraparound; Length: 1.6mm; Width: 0.8mm; Height: 0.8mm; Reach SVHC Compliant: Yes; RoHS Compliant: Yes; ComponentLink1URL: https://datasheet.ciiva.com:443/pdfs/VipMasterIC/IC/YAGO/YAGO-S-A0003557223/YAGO-S-A0003557223-1.pdf?src-supplier=IHS+Markit; ComponentLink1Description: https://datasheet.ciiva.com:443/pdfs/VipMasterIC/IC/YAGO/YAGO-S-A0003557223/YAGO-S-A0003557223-1.pdf?src-supplier=IHS+Markit; ComponentLink2URL: https://datasheet.ciiva.com/8033/1734573-8033801.pdf?src-supplier=Element14; ComponentLink2Description: https://datasheet.ciiva.com/8033/1734573-8033801.pdf?src-supplier=Element14; ComponentLink3URL: https://datasheet.ciiva.com/8033/1734573-8033800.pdf?src-supplier=Element14; ComponentLink3Description: https://datasheet.ciiva.com/8033/1734573-8033800.pdf?src-supplier=Element14; ComponentLink4URL: https://datasheet.ciiva.com/7978/1489800-7978143.pdf?src-supplier=Element14; ComponentLink4Description: https://datasheet.ciiva.com/7978/1489800-7978143.pdf?src-supplier=Element14; ComponentLink5URL: https://datasheet.ciiva.com/28450/1489800-28450557.pdf?src-supplier=Element14; ComponentLink5Description: https://datasheet.ciiva.com/28450/1489800-28450557.pdf?src-supplier=Element14; ComponentLink6URL: https://datasheet.ciiva.com/176/mlccorderingcode-176789.pdf?src-supplier=Digikey; ComponentLink6Description: https://datasheet.ciiva.com/176/mlccorderingcode-176789.pdf?src-supplier=Digikey; ComponentLink7URL: https://datasheet.ciiva.com/176/mlccorderingcode-176788.pdf?src-supplier=Digikey; ComponentLink7Description: https://datasheet.ciiva.com/176/mlccorderingcode-176788.pdf?src-supplier=Digikey; ComponentLink8URL: https://datasheet.ciiva.com/176/mlccorderingcode-176790.pdf?src-supplier=Digikey; ComponentLink8Description: https://datasheet.ciiva.com/176/mlccorderingcode-176790.pdf?src-supplier=Digikey; ComponentLink9URL: https://datasheet.ciiva.com/5425/upy-gphc-x7r-6-3v-to-50v-8-12304-5425495.pdf?src-supplier=Mouser; ComponentLink9Description: https://datasheet.ciiva.com/5425/upy-gphc-x7r-6-3v-to-50v-8-12304-5425495.pdf?src-supplier=Mouser
C62 = CC0603KRX7R7BB104: Ceramic Capacitor, Multilayer, Ceramic, 16V, 10% +Tol, 10% -Tol, X7R, 15% TC, 0.1uF, Surface Mount, 0603 https://www.digikey.ie/en/products/detail/yageo/CC0603KRX7R7BB104/302822; Manufacturer: Yageo; Value: 100nF; Multilayer: Yes; Supplier: Digikey; Supplier Part Number: 311-1088-1-ND; Manufacturer Part Number: CC0603KRX7R7BB104; RoHS: Yes; Category: Ceramic Capacitors; Stock: 8597331; Mounting Technology: Surface Mount; Pins: 2; Dielectric Material: Ceramic; Package Shape: Rectangular; Case/Package: 0603; Terminal Finish: Nickel; Min Operating Temperature: -55°C; Max Operating Temperature: 125°C; JESD-609 Code: e3; Capacitor Type: Ceramic; Tolerance  (fill in as +-): 10%; Package Style: SMTMeter; Packaging: Tape and Reel; Tolerance (fill in as +-): 10%; Rated DC Voltage (URdc): 16V; Temperature Characteristics Code: X7R; Termination: Wraparound; Length: 1.6mm; Width: 0.8mm; Height: 0.8mm; Reach SVHC Compliant: Yes; RoHS Compliant: Yes; ComponentLink1URL: https://datasheet.ciiva.com:443/pdfs/VipMasterIC/IC/YAGO/YAGO-S-A0003557223/YAGO-S-A0003557223-1.pdf?src-supplier=IHS+Markit; ComponentLink1Description: https://datasheet.ciiva.com:443/pdfs/VipMasterIC/IC/YAGO/YAGO-S-A0003557223/YAGO-S-A0003557223-1.pdf?src-supplier=IHS+Markit; ComponentLink2URL: https://datasheet.ciiva.com/11786/0900766b80d84f1d-11786077.pdf?src-supplier=Rs; ComponentLink2Description: https://datasheet.ciiva.com/11786/0900766b80d84f1d-11786077.pdf?src-supplier=Rs; ComponentLink3URL: https://datasheet.ciiva.com/8033/70765-8033799.pdf?src-supplier=Element14; ComponentLink3Description: https://datasheet.ciiva.com/8033/70765-8033799.pdf?src-supplier=Element14; ComponentLink4URL: https://datasheet.ciiva.com/7978/1489800-7978141.pdf?src-supplier=Element14; ComponentLink4Description: https://datasheet.ciiva.com/7978/1489800-7978141.pdf?src-supplier=Element14; ComponentLink5URL: https://datasheet.ciiva.com/28450/1489800-28450552.pdf?src-supplier=Element14; ComponentLink5Description: https://datasheet.ciiva.com/28450/1489800-28450552.pdf?src-supplier=Element14; ComponentLink6URL: https://datasheet.ciiva.com/46430/1734573-46430156.pdf?src-supplier=Element14; ComponentLink6Description: https://datasheet.ciiva.com/46430/1734573-46430156.pdf?src-supplier=Element14; ComponentLink7URL: https://datasheet.ciiva.com/144/mlccorderingcode-144183.pdf?src-supplier=Digikey; ComponentLink7Description: https://datasheet.ciiva.com/144/mlccorderingcode-144183.pdf?src-supplier=Digikey; ComponentLink8URL: https://datasheet.ciiva.com/144/mlccorderingcode-144182.pdf?src-supplier=Digikey; ComponentLink8Description: https://datasheet.ciiva.com/144/mlccorderingcode-144182.pdf?src-supplier=Digikey; ComponentLink9URL: https://datasheet.ciiva.com/144/mlccorderingcode-144184.pdf?src-supplier=Digikey; ComponentLink9Description: https://datasheet.ciiva.com/144/mlccorderingcode-144184.pdf?src-supplier=Digikey; ComponentLink10URL: https://datasheet.ciiva.com/8033/1734573-8033797.pdf?src-supplier=Element14; ComponentLink10Description: https://datasheet.ciiva.com/8033/1734573-8033797.pdf?src-supplier=Element14; ComponentLink11URL: https://datasheet.ciiva.com/13395/upy-gphc-x7r-6-3v-to-50v-8-13395674.pdf?src-supplier=Mouser; ComponentLink11Description: https://datasheet.ciiva.com/13395/upy-gphc-x7r-6-3v-to-50v-8-13395674.pdf?src-supplier=Mouser
CMP = TLV1872DGSR: Integrated Circuit; Manufacturer_Name: Texas Instruments; Datasheet Link: https://www.ti.com.cn/cn/lit/ds/symlink/tlv1872.pdf?ts=1725938037960&ref_url=https%253A%252F%252Fwww.ti.com.cn%252Fproduct%252Fcn%252FTLV1872; Height: 1.1mm; Manufacturer_Part_Number: TLV1872DGSR; Mouser Part Number: 595-TLV1872DGSR; Mouser Price/Stock: https://www.mouser.co.uk/ProductDetail/Texas-Instruments/TLV1872DGSR?qs=ZcfC38r4PotGaIsZlTBhhw%3D%3D; Arrow Part Number: TLV1872DGSR; Arrow Price/Stock: https://www.arrow.com/en/products/tlv1872dgsr/texas-instruments?utm_currency=USD&region=nac
D19 D20 = CMP-2000-04943-2: DIODE SCHOTTKY 40V 1A SMA; Manufacturer: ON Semiconductor; Peak Reverse Current: 0.2mA; Max Junction Temp: +125°C; Standoff Height: 0.05mm; Max Surge Forward Current: 40A; Mouser Description: Schottky Diodes & Rectifiers SMA 40V 1.0A; RoHS: TRUE; Lead Free: Yes; Manufacturer Part Number: SS14; Device Class L3: Schottky Diodes; Category: Diode; Automotive: No; Digikey Description: DIODE SCHOTTKY 40V 1A SMA; ComponentLink2Description: Datasheet; Device Class L2: Diodes; Height: 2.5mm; Temperature Range High: +125°C; ComponentLink2URL: https://www.onsemi.com/pub/Collateral/SS19-D.PDF; Device Class L1: Discrete Semiconductors; Package: 403AE; Octopart: https://octopart.com/ss14-on+semiconductor-29205033; Max Repetitive Reverse Voltage: 40V; Temperature Range Low: -65°C; Forward Current: 1A; Temperature: -65°C to +125°C
IC3 = DMN601DMK-7: MOSFET (N-Channel); Manufacturer_Name: Diodes Incorporated; Datasheet Link: https://www.diodes.com//assets/Datasheets/ds30657.pdf; Height: 1.4mm; Manufacturer_Part_Number: DMN601DMK-7; Mouser Part Number: 621-DMN601DMK-7; Mouser Price/Stock: https://www.mouser.co.uk/ProductDetail/Diodes-Incorporated/DMN601DMK-7?qs=mQbszxtPdlMzhImbd%2FELhA%3D%3D; Arrow Part Number: DMN601DMK-7; Arrow Price/Stock: https://www.arrow.com/en/products/dmn601dmk-7/diodes-incorporated
J22 J23 J_SP_IN = CMP-02766-001743-1: as J_EN_GD on sheet BiGaN; Termination: Solder; RoHS Compliant: Yes; Mount: Through Hole; Lead Free: Lead Free; Connector Type: Header; REACH SVHC: No SVHC; Insulation Color: Black; Width: 2.54mm; Length: 7.62mm; Flammability Rating: UL94 V-0; Housing Material: Polyester; Contact Material: Bronze; Max Operating Temperature: 125°C; Fastening Type: Pull; Series: TSW; Number of Contacts: 3; Packaging: Bulk; Min Operating Temperature: -55°C; Package Quantity: 1; Height: 10.67mm; Pitch: 2.54mm; Contact Finish - Mating: GOLD; Contact Type: Male Pin; Radiation Hardening: No; Color: Black; Housing Color: Black; Contact Plating: Gold; Orientation: Straight; Number of Rows: 1; Depth: 2.54mm; Insulation Material: PBT; Contact Mating Length: 0.32inch; Contact Shape: Square
R33 R34 R37 R40 R42 = RC0603FR-07100RL: as R47 on sheet BiGaN; Datasheet Link: http://www.yageo.com/documents/recent/PYu-RC0603_51_RoHS_L_v5.pdf; Height: 0.55mm; Manufacturer_Part_Number: RC0603FR-07100RL; Mouser Part Number: 603-RC0603FR-07100RL; Mouser Price/Stock: https://www.mouser.co.uk/ProductDetail/YAGEO/RC0603FR-07100RL?qs=NEN%2FsE%2FLsvPIwIWKCOS4%2FA%3D%3D; Arrow Part Number: RC0603FR-07100RL; Arrow Price/Stock: https://www.arrow.com/en/products/rc0603fr-07100rl/yageo?region=europe
R35 R36 = CMP-07234-000050-1: TRIMMER 500KOHM 0.25W PC PIN TOP; Resistance Tolerance: 10%; Voltage Rating: 300V; Power Rating: 250mW; Resistance: 500kR; Lead Diameter: 0.5mm; Temperature Coefficient: 100ppm/°C; Number of Turns: 12; Resistor Type: Cermet; Type: Potentiometer; Height: 0.27inch; Packaging: Rail/Tube; Max Power Dissipation: 250mW; Voltage Rating (DC): 300V; Length: 6.71mm; Mount: Through Hole; Weight: 0.015oz; Depth: 4.5mm; Military Standard: Not; RoHS Compliant: Yes; Package Quantity: 100; Max Operating Temperature: 125°C; Width: 4.5mm; Lead Free: Lead Free; Tolerance: 10%; Radiation Hardening: No; Series: 3266; Technology: CERMET; Min Operating Temperature: -55°C; Termination: Pin; REACH SVHC: No SVHC; Color: Blue
R41 R43 = RC0603FR-07100KL: Resistor, 100 kOhms ±1% 0.1W, 1/10W Chip Resistor 0603 (1608 Metric) Moisture Resistant Thick Film; Manufacturer_Name: YAGEO; Datasheet Link: https://www.yageo.com/upload/media/product/productsearch/datasheet/rchip/PYu-RC_Group_51_RoHS_L_12.pdf; Height: 0.55mm; Manufacturer_Part_Number: RC0603FR-07100KL; Mouser Part Number: 603-RC0603FR-07100KL; Mouser Price/Stock: https://www.mouser.co.uk/ProductDetail/YAGEO/RC0603FR-07100KL?qs=e1ok2LiJcmaihem8Va5%2Fsw%3D%3D; Arrow Part Number: RC0603FR-07100KL; Arrow Price/Stock: https://www.arrow.com/en/products/rc0603fr-07100kl/yageo?utm_currency=USD&region=europe
R56 R57 = CMP-02407-013067-1: RES SMD 50K OHM 0.02% 1/10W 0603; Temperature Coefficient: 5ppm/°C; Max Power Dissipation: 100mW; Resistance: 50kR; Max Operating Temperature: 125°C; Min Operating Temperature: -55°C; Case Code (Metric): 1608; Features: Moisture Resistant; Resistor Type: Thin Film; Packaging: Cut Tape; Case/Package: 0603; Tolerance: 0.02%; Number of Terminations: 2; Case Code (Imperial): 0603
U4 = CMP-09133-000053-1: DGTL ISO 5KV 1CH GATE DRVR 6SOIC; Number of Channels: 1; Pulse Width Distortion (PWD): 16.5ns; Max Output Current: 2.3A; Propagation Delay: 79ns; Approvals: CSA; Number of Pins: 6; Series: iCoupler®; Mount: Surface Mount; Max Operating Temperature: 125°C; RoHS Compliant: Yes; Packaging: Rail/Tube; Min Operating Temperature: -40°C; Case/Package: SOIC
U5 = CMP-09139-000695-1: IC REG CHARGE PUMP INV 18DFN; Min Input Voltage: 4.5V; Output Current: 100mA; Synchronous Rectifier: No; Number of Outputs: 2; Output Type: Fixed; Switching Frequency: 500kHz; Max Input Voltage: 32V; Number of Pins: 18; Min Operating Temperature: -55°C; Mount: Surface Mount; RoHS Compliant: Yes; Packaging: Rail/Tube; Case/Package: DFN; Topology: Charge Pump; Series: -; Max Operating Temperature: 150°C

## Sheet AdjustableLDO.SchDoc
size A3; SheetNumber: 2; SheetTotal: 6
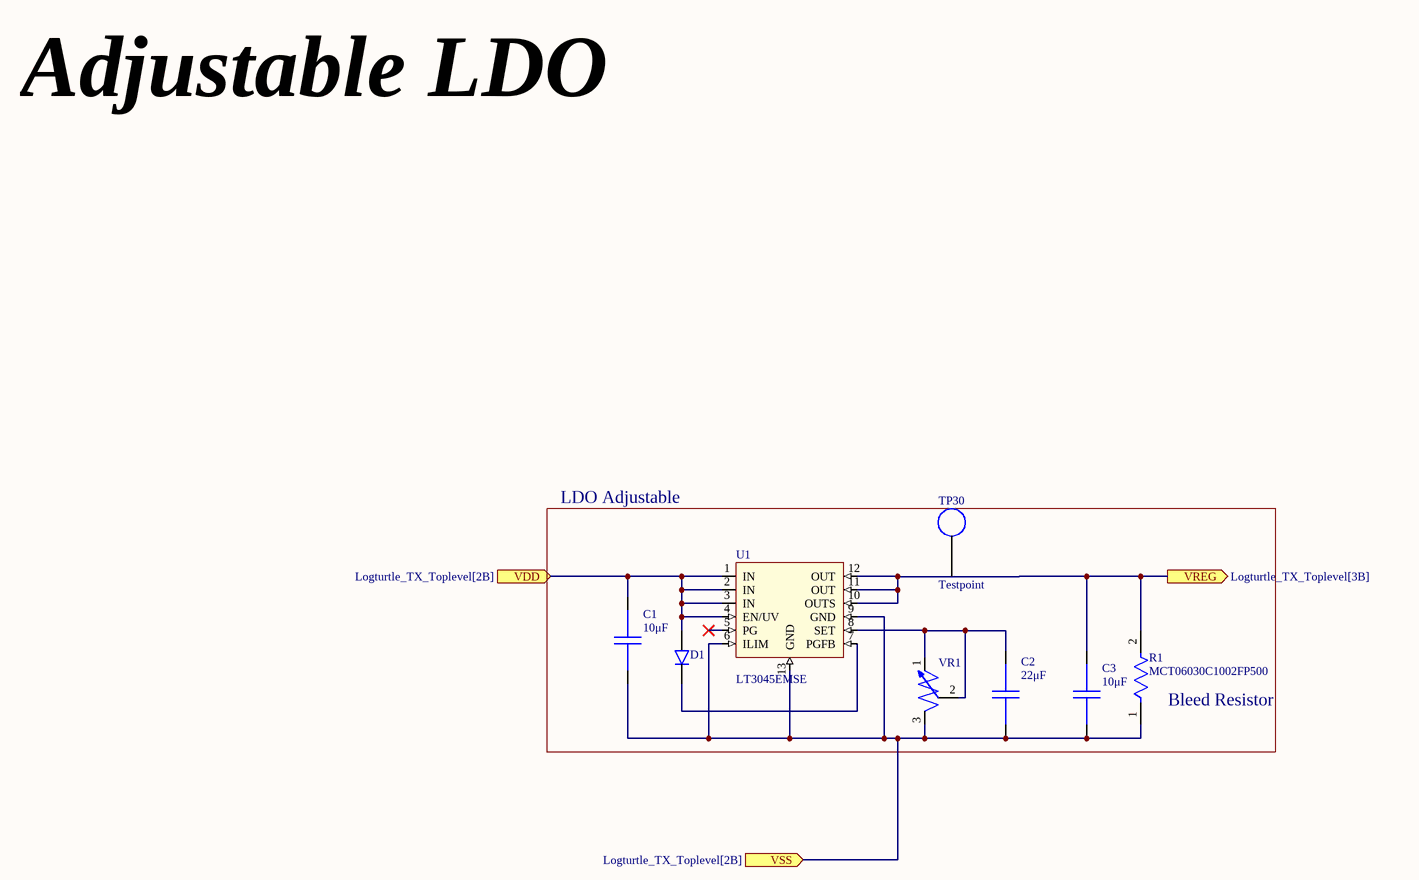
[diagram p6: AdjustableLDO.SchDoc]

### Parts
C1  10μF  [CAPC2012X14N]
C2  22μF  [CAPC3225X27N]
C3  10μF  [CAPC2012X14N]
D1  (no value)  [SODFL160X70-2N]
R1  MCT06030C1002FP500  [FP-MCT0603-IPC_C]
TP30  Testpoint  [TP_5006]
U1  LT3045EMSE  [TSOP65P490X110_HS-13N]
VR1  (no value)  [3296W]

### Ports
VDD (in, see Logturtle_TX_Toplevel[2B]), VREG (out, see Logturtle_TX_Toplevel[3B]), VSS (in, see Logturtle_TX_Toplevel[2B])

### Nets
S2: C1.1 C2.1 C3.1 R1.1 U1.6(ILIM) U1.9(GND) U1.13(GND) VR1.3 ; port VSS
AVDD5VREG: C3.2 R1.2 TP30.1 U1.10(OUTS) U1.11(OUT) U1.12(OUT) ; port VREG
NetC1_2: C1.2 D1.1(Anode) U1.1(IN) U1.2(IN) U1.3(IN) U1.4(EN/UV) ; port VDD
NetC2_2: C2.2 U1.8(SET) VR1.1(CW) VR1.2(CCW)
NetD1_2: D1.2(Cathode) U1.7(PGFB)

Not connected (* = marked no-connect by the designer): U1 5(PG)*

### Notes on the sheet
- Adjustable LDO
- LDO Adjustable
- (near R1) Bleed Resistor

### Library data of the parts
C1 C3 = GRM21BZ71E106KE15L: Multilayer Ceramic Capacitor, 10 uF, 25 V, ï¿½ 10%, X7R, 0805 [2012 Metric] https://www.digikey.ie/en/products/detail/murata-electronics/GRM21BZ71E106KE15L/13904911; Manufacturer: Murata; Material: 4241ConductorMaterial; Value: 10uF; Voltage Rating: 25V; Supplier: Future Electronics; Supplier Part Number: 6134628; Manufacturer Part Number: GRM21BZ71E106KE15L; Category: Ceramic Capacitors; Stock: 81000; Case/Package: 339Case; Min Operating Temperature: -55°C; Max Operating Temperature: 125°C; Tolerance: 10%; Length: 2mm; Width: 1.25mm; Height: 1.45mm; Thickness: 1.25mm; RoHS Compliant: Yes; ComponentLink1URL: https://datasheet.octopart.com/GRM21BZ71E106KE15L-Murata-datasheet-141278873.pdf?src-supplier=Geoflip; ComponentLink1Description: https://datasheet.octopart.com/GRM21BZ71E106KE15L-Murata-datasheet-141278873.pdf?src-supplier=Geoflip; ComponentLink2URL: https://datasheet.octopart.com/GRM21BZ71E106KE15L-Murata-datasheet-165579666.pdf?src-supplier=TME; ComponentLink2Description: https://datasheet.octopart.com/GRM21BZ71E106KE15L-Murata-datasheet-165579666.pdf?src-supplier=TME; ComponentLink3URL: https://datasheet.octopart.com/GRM21BZ71E106KE15L-Murata-datasheet-140707837.pdf?src-supplier=Ciiva+Crawler; ComponentLink3Description: https://datasheet.octopart.com/GRM21BZ71E106KE15L-Murata-datasheet-140707837.pdf?src-supplier=Ciiva+Crawler; ComponentLink4URL: https://datasheet.octopart.com/GRM21BZ71E106KE15L-Murata-datasheet-138745134.pdf?src-supplier=Ciiva+Crawler; ComponentLink4Description: https://datasheet.octopart.com/GRM21BZ71E106KE15L-Murata-datasheet-138745134.pdf?src-supplier=Ciiva+Crawler
C2 = CC1210KKX7R7BB226: Ceramic Capacitor, Multilayer, Ceramic, 16V, 10% +Tol, 10% -Tol, X7R, 15% TC, 22uF, Surface Mount, 1210 https://www.digikey.ie/en/products/detail/yageo/CC1210KKX7R7BB226/5195434; Manufacturer: Yageo; Multilayer: Yes; Supplier: Rs; Supplier Part Number: 1992345; Manufacturer Part Number: CC1210KKX7R7BB226; RoHS: Yes; Category: Ceramic Capacitors; Stock: 1770; Pricing: 10=0.332, 100=0.248, 500=0.216, 1000=0.198 (EUR); Mounting Technology: Surface Mount; Pins: 2; Dielectric Material: Ceramic; Package Shape: Rectangular; Case/Package: 1210; Terminal Finish: Nickel; Min Operating Temperature: -55°C; Max Operating Temperature: 125°C; JESD-609 Code: e3; Value: 22uF; Capacitor Type: Ceramic; Tolerance  (fill in as +-): 10%; Package Style: SMTMeter; Packaging: Tape and Reel; Tolerance (fill in as +-): 10%; Rated DC Voltage (URdc): 16V; Temperature Characteristics Code: X7R; Termination: Wraparound; Length: 3.2mm; Width: 2.5mm; Height: 2.5mm; Reach SVHC Compliant: Yes; RoHS Compliant: Yes; ComponentLink1URL: https://datasheet.ciiva.com:443/pdfs/VipMasterIC/IC/YAGO/YAGO-S-A0003557223/YAGO-S-A0003557223-1.pdf?src-supplier=IHS+Markit; ComponentLink1Description: https://datasheet.ciiva.com:443/pdfs/VipMasterIC/IC/YAGO/YAGO-S-A0003557223/YAGO-S-A0003557223-1.pdf?src-supplier=IHS+Markit; ComponentLink2URL: https://datasheet.ciiva.com/11465/upy-gphc-x7r-6-3v-to-50v-8-11465512.pdf?src-supplier=Avnet; ComponentLink2Description: https://datasheet.ciiva.com/11465/upy-gphc-x7r-6-3v-to-50v-8-11465512.pdf?src-supplier=Avnet
D1 = 1N4148WT: Rectifier Diode, 1 Phase, 1 Element, 0.3A, 75V V(RRM), Silicon https://www.digikey.ie/en/products/detail/onsemi/1N4148WT/1954014; Manufacturer: ON Semiconductor / Fairchild; Supplier: Rs; Supplier Part Number: 7614283P; Manufacturer Part Number: 1N4148WT; RoHS: Yes; Category: Rectifier Diodes; Stock: 67900; Pricing: 500=0.029, 1000=0.025, 2500=0.022 (EUR); Diode Type: RECTIFIER; RoHS Compliant: Yes; ComponentLink1URL: https://datasheet.ciiva.com/16744/1n4148wt-16744972.pdf?src-supplier=Future+Electronics; ComponentLink1Description: https://datasheet.ciiva.com/16744/1n4148wt-16744972.pdf?src-supplier=Future+Electronics; ComponentLink2URL: https://datasheet.ciiva.com/30479/0900766b810e1cd4-30479226.pdf?src-supplier=Rs; ComponentLink2Description: https://datasheet.ciiva.com/30479/0900766b810e1cd4-30479226.pdf?src-supplier=Rs; ComponentLink3URL: https://datasheet.ciiva.com/15208/getdatasheetpartid-146392-15208359.pdf?src-supplier=Verical; ComponentLink3Description: https://datasheet.ciiva.com/15208/getdatasheetpartid-146392-15208359.pdf?src-supplier=Verical; ComponentLink4URL: https://datasheet.ciiva.com/916/1n914bwt-916865.pdf?src-supplier=Digikey; ComponentLink4Description: https://datasheet.ciiva.com/916/1n914bwt-916865.pdf?src-supplier=Digikey; ComponentLink5URL: https://datasheet.ciiva.com/916/1n914bwt-916866.pdf?src-supplier=Digikey; ComponentLink5Description: https://datasheet.ciiva.com/916/1n914bwt-916866.pdf?src-supplier=Digikey; ComponentLink6URL: https://datasheet.ciiva.com/916/1n914bwt-916864.pdf?src-supplier=Digikey; ComponentLink6Description: https://datasheet.ciiva.com/916/1n914bwt-916864.pdf?src-supplier=Digikey
R1 = CMP-02407-000418-1: RES SMD 100 OHM 1% 1/8W 0603; Voltage Rating: 75V; Power Rating: 100mW; Temperature Coefficient: 50ppm/°C; Max Power Dissipation: 125mW; Resistance: 10kR; Case/Package: 0603; Military Standard: Not; Min Operating Temperature: -55°C; Width: 0.8mm; Package Quantity: 1; Max Operating Temperature: 125°C; Tolerance: 1%; Depth: 0.85mm; Radiation Hardening: No; Mount: Surface Mount; Composition: Thin Film; Contact Plating: Tin; Lead Free: Lead Free; Case Code (Imperial): 0603; Number of Terminations: 2; Voltage Rating (DC): 75V; Length: 1.55mm; Packaging: Tape and Reel; Height: 0.022inch; Case Code (Metric): 1608
U1 = LT3045EMSE: 20V, 500mA, Ultralow Noise, Ultrahigh PSRR Linear Regulator  https://www.digikey.ie/en/products/detail/analog-devices-inc/LT3045EMSE-PBF/6234771
VR1 = 3296W-1-203LF: Trimmer, Cermet, 0.5W, 20000ohm, 300V, 10% +/-Tol, 100ppm/Cel, 25 Turn(s) https://www.bourns.com/docs/product-datasheets/3296.pdf; Manufacturer: Bourns; Actuator Orientation: Vertical; Actuator Type: SCREW; Number of Turns: 25; Power: 500mW; Rated Temperature: 70°C; Value: 20kR; Resistance Law: Linear; Rotational Angle: 9000°; Temperature Coefficient: -100100ppm/°C; Lead Diameter: 0.51mm; Lead Length: 6.4mm; Package Height: 10.03mm; Package Length: 9.53mm; Package Width: 4.83mm; Supplier: Digikey; Supplier Part Number: 3296W-203LF-ND; Manufacturer Part Number: 3296W-1-203LF; RoHS: Yes; Category: Variable Resistors and Potentiometers; Stock: 2018; Mounting Technology: Through Hole; Pins: 3; Package Shape: Rectangular; Case/Package: 3819; Terminal Finish: Tin; Min Operating Temperature: -55°C; Max Operating Temperature: 125°C; Tolerance: 10%; JESD-609 Code: e3; Resistor Type: TRIMMER; Construction: Trimmer Pot; Package Style: PCB MountMeter; Packaging: Rail/Tube; Technology: CERMET; Termination: Wire; RoHS Compliant: Yes; Reach SVHC Compliant: No; ComponentLink1URL: https://datasheet.ciiva.com:443/pdfs/VipMasterIC/IC/BOUR/BOUR-S-A0008796795/BOUR-S-A0008796795-1.pdf?src-supplier=IHS+Markit; ComponentLink1Description: https://datasheet.ciiva.com:443/pdfs/VipMasterIC/IC/BOUR/BOUR-S-A0008796795/BOUR-S-A0008796795-1.pdf?src-supplier=IHS+Markit; ComponentLink2URL: https://datasheet.ciiva.com/14173/ew3296-dat-e-14173023.pdf?src-supplier=Distrelec; ComponentLink2Description: https://datasheet.ciiva.com/14173/ew3296-dat-e-14173023.pdf?src-supplier=Distrelec; ComponentLink3URL: https://datasheet.ciiva.com/15156/getdatasheetpartid-62506-15156343.pdf?src-supplier=Verical; ComponentLink3Description: https://datasheet.ciiva.com/15156/getdatasheetpartid-62506-15156343.pdf?src-supplier=Verical

## Sheet Reference.SchDoc
size A3; SheetNumber: 7; SheetTotal: 8
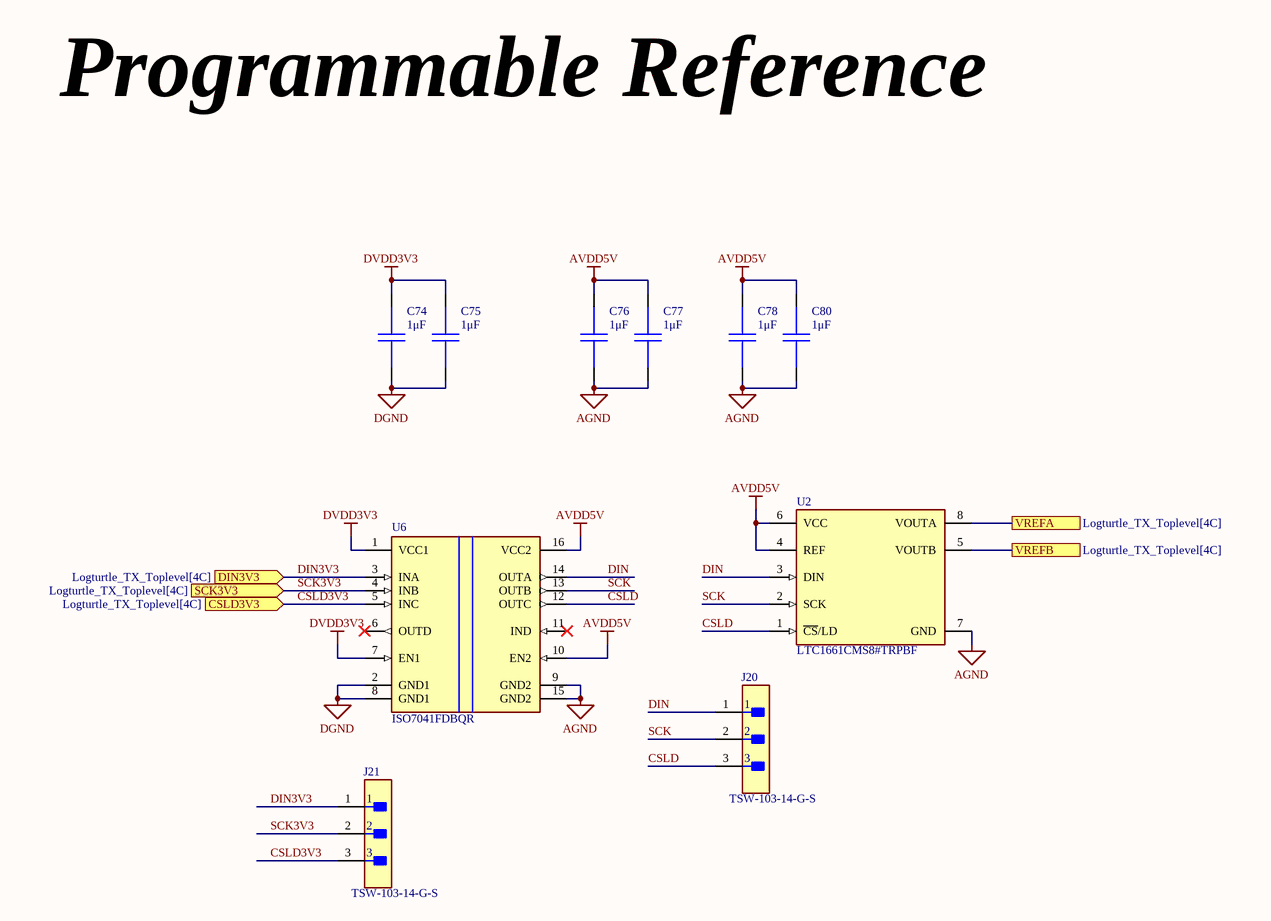
[diagram p7: Reference.SchDoc]

### Parts
C74  1μF  [CAPC1608X09N]
C75  1μF  [CAPC1608X09N]
C76  1μF  [CAPC1608X09N]
C77  1μF  [CAPC1608X09N]
C78  1μF  [CAPC1608X09N]
C80  1μF  [CAPC1608X09N]
J20  TSW-103-14-G-S  [FP-TSW-103-14-G-S-MFG]
J21  TSW-103-14-G-S  [FP-TSW-103-14-G-S-MFG]
U2  LTC1661CMS8#TRPBF  [FP-MS8-8-05-08-1660-IPC_B]
U6  ISO7041FDBQR  [FP-DBQ0016A-MFG]

### Ports
CSLD3V3 (in, see Logturtle_TX_Toplevel[4C]), DIN3V3 (in, see Logturtle_TX_Toplevel[4C]), SCK3V3 (in, see Logturtle_TX_Toplevel[4C]), VREFA (see Logturtle_TX_Toplevel[4C]), VREFB (see Logturtle_TX_Toplevel[4C])

### Nets
AGND: C76.1 C77.1 C78.1 C80.1 U2.7(GND) U6.9(GND2) U6.15(GND2)  [project net S2]
AVDD5V: C76.2 C77.2 C78.2 C80.2 U2.4(REF) U2.6(VCC) U6.10(EN2) U6.16(VCC2)
DGND: C74.1 C75.1 U6.2(GND1) U6.8(GND1)  [project net GND]
DVDD3V3: C74.2 C75.2 U6.1(VCC1) U6.7(EN1)
CSLD: J20.3 U2.1(~{CS}/LD) U6.12(OUTC)
CSLD3V3: J21.3 U6.5(INC) ; port CSLD3V3
DIN: J20.1 U2.3(DIN) U6.14(OUTA)
DIN3V3: J21.1 U6.3(INA) ; port DIN3V3
SCK: J20.2 U2.2(SCK) U6.13(OUTB)
SCK3V3: J21.2 U6.4(INB) ; port SCK3V3  [project net P94]
VREF1EXT: U2.8(VOUTA) ; port VREFA
VREF2EXT: U2.5(VOUTB) ; port VREFB

Not connected (* = marked no-connect by the designer): U6 6(OUTD)* 11(IND)*

### Notes on the sheet
- Programmable Reference

### Library data of the parts
C74-C78 C80 = CC0603KRX7R7BB105: as C61 on sheet ComparatorSense; Supplier: Digikey; Supplier Part Number: 311-1446-6-ND; Manufacturer Part Number: CC0603KRX7R7BB105; RoHS: Yes; Category: Ceramic Capacitors; Stock: 9128438; Mounting Technology: Surface Mount; Pins: 2; Dielectric Material: Ceramic; Package Shape: Rectangular; Case/Package: 0603; Terminal Finish: Nickel; Min Operating Temperature: -55°C; Max Operating Temperature: 125°C; JESD-609 Code: e3; Value: 1uF; Capacitor Type: Ceramic; Tolerance  (fill in as +-): 10%; Package Style: SMTMeter; Packaging: Tape and Reel; Tolerance (fill in as +-): 10%; Rated DC Voltage (URdc): 16V; Temperature Characteristics Code: X7R; Termination: Wraparound; Length: 1.6mm; Width: 0.8mm; Height: 0.8mm; Reach SVHC Compliant: Yes; RoHS Compliant: Yes; ComponentLink1URL: https://datasheet.ciiva.com:443/pdfs/VipMasterIC/IC/YAGO/YAGO-S-A0003557223/YAGO-S-A0003557223-1.pdf?src-supplier=IHS+Markit; ComponentLink1Description: https://datasheet.ciiva.com:443/pdfs/VipMasterIC/IC/YAGO/YAGO-S-A0003557223/YAGO-S-A0003557223-1.pdf?src-supplier=IHS+Markit; ComponentLink2URL: https://datasheet.ciiva.com/8033/1734573-8033801.pdf?src-supplier=Element14; ComponentLink2Description: https://datasheet.ciiva.com/8033/1734573-8033801.pdf?src-supplier=Element14; ComponentLink3URL: https://datasheet.ciiva.com/8033/1734573-8033800.pdf?src-supplier=Element14; ComponentLink3Description: https://datasheet.ciiva.com/8033/1734573-8033800.pdf?src-supplier=Element14; ComponentLink4URL: https://datasheet.ciiva.com/7978/1489800-7978143.pdf?src-supplier=Element14; ComponentLink4Description: https://datasheet.ciiva.com/7978/1489800-7978143.pdf?src-supplier=Element14; ComponentLink5URL: https://datasheet.ciiva.com/28450/1489800-28450557.pdf?src-supplier=Element14; ComponentLink5Description: https://datasheet.ciiva.com/28450/1489800-28450557.pdf?src-supplier=Element14; ComponentLink6URL: https://datasheet.ciiva.com/176/mlccorderingcode-176789.pdf?src-supplier=Digikey; ComponentLink6Description: https://datasheet.ciiva.com/176/mlccorderingcode-176789.pdf?src-supplier=Digikey; ComponentLink7URL: https://datasheet.ciiva.com/176/mlccorderingcode-176788.pdf?src-supplier=Digikey; ComponentLink7Description: https://datasheet.ciiva.com/176/mlccorderingcode-176788.pdf?src-supplier=Digikey; ComponentLink8URL: https://datasheet.ciiva.com/176/mlccorderingcode-176790.pdf?src-supplier=Digikey; ComponentLink8Description: https://datasheet.ciiva.com/176/mlccorderingcode-176790.pdf?src-supplier=Digikey; ComponentLink9URL: https://datasheet.ciiva.com/5425/upy-gphc-x7r-6-3v-to-50v-8-12304-5425495.pdf?src-supplier=Mouser; ComponentLink9Description: https://datasheet.ciiva.com/5425/upy-gphc-x7r-6-3v-to-50v-8-12304-5425495.pdf?src-supplier=Mouser
J20 J21 = CMP-02766-001743-1: as J_EN_GD on sheet BiGaN; Termination: Solder; RoHS Compliant: Yes; Mount: Through Hole; Lead Free: Lead Free; Connector Type: Header; REACH SVHC: No SVHC; Insulation Color: Black; Width: 2.54mm; Length: 7.62mm; Flammability Rating: UL94 V-0; Housing Material: Polyester; Contact Material: Bronze; Max Operating Temperature: 125°C; Fastening Type: Pull; Series: TSW; Number of Contacts: 3; Packaging: Bulk; Min Operating Temperature: -55°C; Package Quantity: 1; Height: 10.67mm; Pitch: 2.54mm; Contact Finish - Mating: GOLD; Contact Type: Male Pin; Radiation Hardening: No; Color: Black; Housing Color: Black; Contact Plating: Gold; Orientation: Straight; Number of Rows: 1; Depth: 2.54mm; Insulation Material: PBT; Contact Mating Length: 0.32inch; Contact Shape: Square
U2 = CMP-09082-000102-1: IC DAC 10BIT V-OUT 8MSOP; Output Type: Voltage; Min Supply Voltage: 2.7V; Interface: Serial; Integral Nonlinearity (INL): 2LSB; Resolution: 10b; Max Supply Voltage: 5.5V; Number of Bits: 10; Supply Type: Single; Settling Time: 30us; Number of Converters: 2; Min Operating Temperature: 0°C; Lead Free: Lead Free; Number of Pins: 8; Packaging: Tape and Reel; Mount: Surface Mount; Max Operating Temperature: 70°C; Package Quantity: 2500; Number of Channels: 2; Case/Package: MSOP
U6 = CMP-04872-000242-1: DGTL ISO 3000VRMS 4CH GP 16SSOP; RoHS Compliant: Yes

## Nets that join several sheets
AVDD5V: Logturtle_TX_Toplevel (12 pins), Half_Bridge (R10.1), BiGaN (12 pins), ComparatorSense (7 pins), Reference (8 pins)
DVDD3V3: Logturtle_TX_Toplevel (12 pins), Reference (C74.2 C75.2 U6.1 U6.7)
GND: Logturtle_TX_Toplevel (16 pins), Reference (C74.1 C75.1 U6.2 U6.8)
S2: Logturtle_TX_Toplevel (29 pins), Half_Bridge (66 pins), Tunable_Capacitance (C7.1 C8.1 C9.1 C10.1), BiGaN (26 pins), ComparatorSense (36 pins), AdjustableLDO (8 pins), Reference (7 pins)
VDD_UNREG_HB: Logturtle_TX_Toplevel (D17.2 J6.1 J15.1 TP8.1), Half_Bridge (C23.2 U3.8)
VIN: Logturtle_TX_Toplevel (J1.1 J2.1 TP1.1), Half_Bridge (32 pins)
AVDD5VREG: Logturtle_TX_Toplevel (J3.3 TP7.1), AdjustableLDO (6 pins)
CMP1: Logturtle_TX_Toplevel (IC5.12), ComparatorSense (CMP.2 R41.2 TP25.1)
CMP2: Logturtle_TX_Toplevel (IC5.11), ComparatorSense (CMP.8 R43.2 TP26.1)
CMPRST_1: Logturtle_TX_Toplevel (IC5.14), ComparatorSense (R37.1)
CSLD3V3: Logturtle_TX_Toplevel (J12.13), Reference (J21.3 U6.5)
DIN3V3: Logturtle_TX_Toplevel (J12.15), Reference (J21.1 U6.3)
NetC1_2: Logturtle_TX_Toplevel (J16.1), AdjustableLDO (6 pins)
P94: Logturtle_TX_Toplevel (J12.11), Reference (J21.2 U6.4)
PWM1_1: Logturtle_TX_Toplevel (IC4.12), BiGaN (R46.1)
PWM1_HB: Logturtle_TX_Toplevel (IC4.14), Half_Bridge (R28.1)
PWM2_1: Logturtle_TX_Toplevel (IC4.11), BiGaN (R49.1)
PWM2_HB: Logturtle_TX_Toplevel (IC4.13), Half_Bridge (R30.1)
S1: Tunable_Capacitance (C11.1 C12.1 C13.1 C14.1), BiGaN (10 pins), ComparatorSense (C19.2 C20.2 C21.2 C51.2)
SW: Logturtle_TX_Toplevel (J4.1 J4.2 LTX.2), Tunable_Capacitance (8 pins)
VREF1EXT: ComparatorSense (J22.3), Reference (U2.8)
VREF2EXT: ComparatorSense (J23.3), Reference (U2.5)
VSW: Logturtle_TX_Toplevel (LTX.1), Half_Bridge (39 pins)

## Assembly variants
LOGTURTLE_APR_25_TX: not fitted C7 C8 C9 C10 C11 C12 C13 C14 C19 C20 C21 C51 C56 C57 C58 C59 LTX